# Altium schematic sheet output.SchDoc
size A4
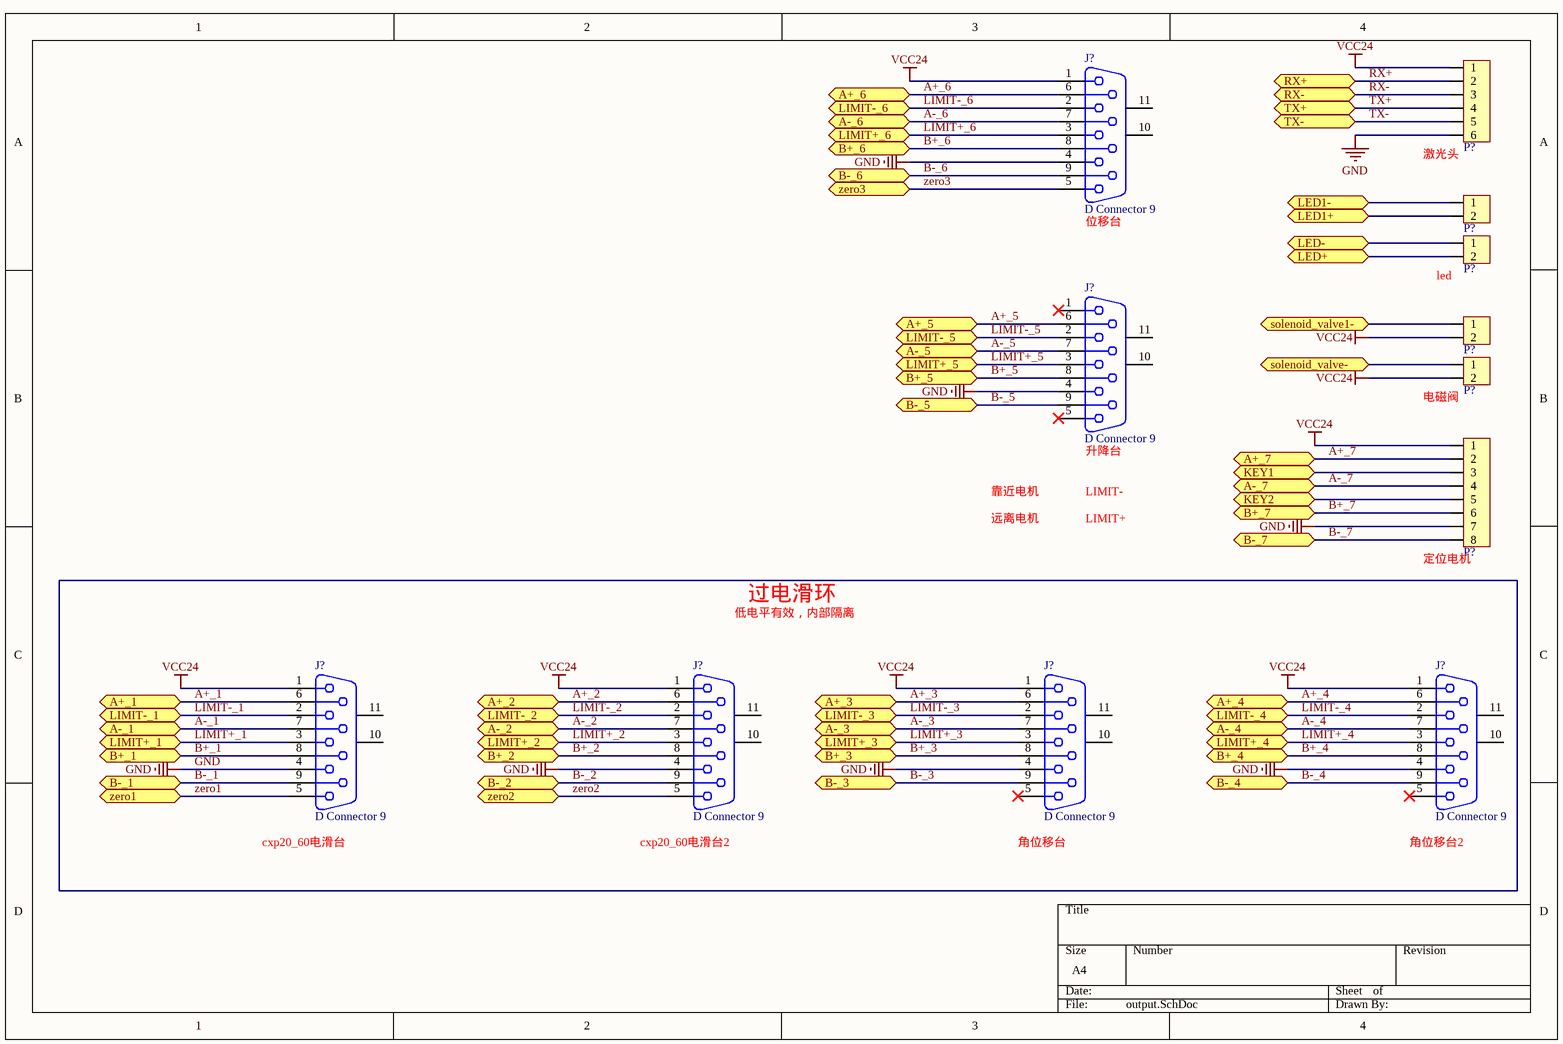
[diagram p0: output.SchDoc]

## Parts
(Parts that share a designator on the sheet are numbered #1, #2 ... from top to bottom, then left to right.)
J?#1  D Connector 9  [DSUB1.385-2H9]
J?#2  D Connector 9  [DSUB1.385-2H9]
J?#3  D Connector 9  [DSUB1.385-2H9]
J?#4  D Connector 9  [DSUB1.385-2H9]
J?#5  D Connector 9  [DSUB1.385-2H9]
J?#6  D Connector 9  [DSUB1.385-2H9]
P?#1  HDR1x6_2.54  [HDR1X6_2.54_180]  (value not drawn)
P?#2  HDR1x2_2.54  [HDR1X2_2.54_180]  (value not drawn)
P?#3  HDR1x2_2.54  [HDR1X2_2.54_180]  (value not drawn)
P?#4  HDR1x2_2.54  [HDR1X2_2.54_180]  (value not drawn)
P?#5  HDR1x2_2.54  [HDR1X2_2.54_180]  (value not drawn)
P?#6  HDR1x8_2.54  [HDR1X8_2.54_180]  (value not drawn)

## Ports
A+_1, A+_2, A+_3, A+_4, A+_5, A+_6, A+_7, A-_1, A-_2, A-_3, A-_4, A-_5, A-_6, A-_7, B+_1, B+_2, B+_3, B+_4, B+_5, B+_6, B+_7, B-_1, B-_2, B-_3, B-_4, B-_5, B-_6, B-_7, KEY1, KEY2, LED1+, LED1-, LED+, LED-, LIMIT+_1, LIMIT+_2, LIMIT+_3, LIMIT+_4, LIMIT+_5, LIMIT+_6, LIMIT-_1, LIMIT-_2, LIMIT-_3, LIMIT-_4, LIMIT-_5, LIMIT-_6, RX+, RX-, solenoid_valve1-, solenoid_valve-, TX+, TX-, zero1, zero2, zero3

## Nets
GND: J?#1.4 J?#2.4 J?#3.4 J?#4.4 J?#5.4 J?#6.4 P?#1.6 P?#6.7
VCC24: J?#1.1 J?#3.1 J?#4.1 J?#5.1 J?#6.1 P?#1.1 P?#4.2 P?#5.2 P?#6.1
A+_1: J?#3.6 ; port A+_1
A+_2: J?#4.6 ; port A+_2
A+_3: J?#5.6 ; port A+_3
A+_4: J?#6.6 ; port A+_4
A+_5: J?#2.6 ; port A+_5
A+_6: J?#1.6 ; port A+_6
A+_7: P?#6.2 ; port A+_7
A-_1: J?#3.7 ; port A-_1
A-_2: J?#4.7 ; port A-_2
A-_3: J?#5.7 ; port A-_3
A-_4: J?#6.7 ; port A-_4
A-_5: J?#2.7 ; port A-_5
A-_6: J?#1.7 ; port A-_6
A-_7: P?#6.4 ; port A-_7
B+_1: J?#3.8 ; port B+_1
B+_2: J?#4.8 ; port B+_2
B+_3: J?#5.8 ; port B+_3
B+_4: J?#6.8 ; port B+_4
B+_5: J?#2.8 ; port B+_5
B+_6: J?#1.8 ; port B+_6
B+_7: P?#6.6 ; port B+_7
B-_1: J?#3.9 ; port B-_1
B-_2: J?#4.9 ; port B-_2
B-_3: J?#5.9 ; port B-_3
B-_4: J?#6.9 ; port B-_4
B-_5: J?#2.9 ; port B-_5
B-_6: J?#1.9 ; port B-_6
B-_7: P?#6.8 ; port B-_7
KEY1: P?#6.3 ; port KEY1
KEY2: P?#6.5 ; port KEY2
LED1+: P?#2.2 ; port LED1+
LED1-: P?#2.1 ; port LED1-
LED+: P?#3.2 ; port LED+
LED-: P?#3.1 ; port LED-
LIMIT+_1: J?#3.3 ; port LIMIT+_1
LIMIT+_2: J?#4.3 ; port LIMIT+_2
LIMIT+_3: J?#5.3 ; port LIMIT+_3
LIMIT+_4: J?#6.3 ; port LIMIT+_4
LIMIT+_5: J?#2.3 ; port LIMIT+_5
LIMIT+_6: J?#1.3 ; port LIMIT+_6
LIMIT-_1: J?#3.2 ; port LIMIT-_1
LIMIT-_2: J?#4.2 ; port LIMIT-_2
LIMIT-_3: J?#5.2 ; port LIMIT-_3
LIMIT-_4: J?#6.2 ; port LIMIT-_4
LIMIT-_5: J?#2.2 ; port LIMIT-_5
LIMIT-_6: J?#1.2 ; port LIMIT-_6
RX+: P?#1.2 ; port RX+
RX-: P?#1.3 ; port RX-
solenoid_valve1-: P?#4.1 ; port solenoid_valve1-
solenoid_valve-: P?#5.1 ; port solenoid_valve-
TX+: P?#1.4 ; port TX+
TX-: P?#1.5 ; port TX-
zero1: J?#3.5 ; port zero1
zero2: J?#4.5 ; port zero2
zero3: J?#1.5 ; port zero3

Not connected (* = marked no-connect by the designer): J?#1 10(MH1) 11(MH2); J?#2 1* 5* 10(MH1) 11(MH2); J?#3 10(MH1) 11(MH2); J?#4 10(MH1) 11(MH2); J?#5 5* 10(MH1) 11(MH2); J?#6 5* 10(MH1) 11(MH2)

## Notes on the sheet
- (near P?#1) 激光头
- (near J?#1) 位移台
- (near P?#3) led
- (near J?#2) 升降台
- (near P?#5) 电磁阀
- 靠近电机
- 远离电机
- LIMIT-
- LIMIT+
- (near P?#6) 定位电机
- 低电平有效，内部隔离
- 过电滑环
- (near J?#3) cxp20_60电滑台
- (near J?#4) cxp20_60电滑台2
- (near J?#5) 角位移台
- (near J?#6) 角位移台2

## Library data of the parts
J?#1-J?#6 = D Connector 9: Receptacle Assembly, 9 Position, Right Angle; PackageDocument: O; Positions: 9; Published: 15-Jun-2001; LatestRevisionDate: 17-Jul-2002; LatestRevisionNote: Re-released for DXP Platform.; DatasheetDocument: 1-Sep-1999; PackageReference: 788750; Publisher: Altium Limited; Orientation: Right Angle; Gender: Receptacle
P?#1 = HDR1x6_2.54: Header
P?#2-P?#5 = HDR1x2_2.54: Header
P?#6 = HDR1x8_2.54: Header